# Altium schematic sheet Battery.SchDoc
size A4; SheetNumber: 3; SheetTotal: 6
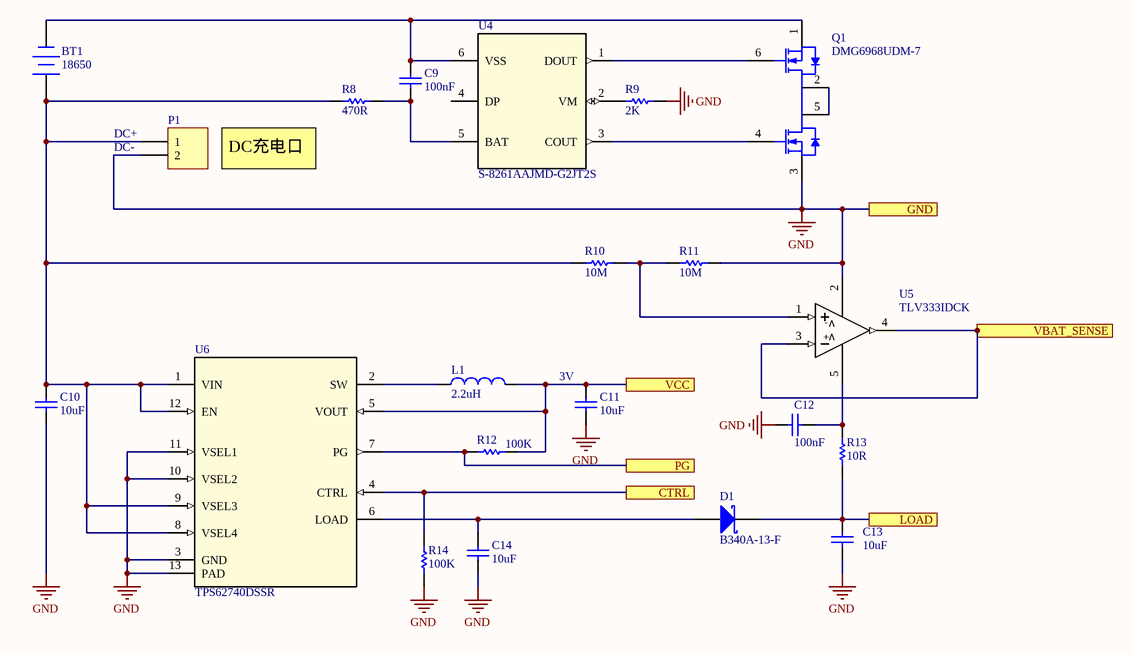
[diagram p0: Battery.SchDoc]

## Parts
BT1  18650  [CP1X2]
C9  100nF  [R0603_C]
C10  10uF  [R0805_C]
C11  10uF  [R0805_C]
C12  100nF  [R0603_C]
C13  10uF  [R0805_C]
C14  10uF  [R0805_C]
D1  B340A-13-F  [SMA(DO-214AC)_S2]
L1  2.2uH  [NR2016]
P1  Header 2  [CP1X2]  (value not drawn)
Q1  DMG6968UDM-7  [DBV0006A_N]
R8  470R  [R0603_R]
R9  2K  [R0603_R]
R10  10M  [R0603_R]
R11  10M  [R0603_R]
R12  100K  [R0603_R]
R13  10R  [R0603_R]
R14  100K  [R0603_R]
U4  S-8261AAJMD-G2JT2S  [DBV0006A_N]
U5  TLV333IDCK  [DCK0005A_N]
U6  TPS62740DSSR  [DSS0012A]

## Ports
CTRL, GND, LOAD, PG, VBAT_SENSE, VCC

## Nets
GND: C10.1 C11.1 C12.1 C13.1 C14.1 P1.2 Q1.3(S2) R9.2 R11.1 R14.1 U5.2(V-) U6.3(GND) U6.10(VSEL2) U6.11(VSEL1) U6.13(PAD) ; port GND
CTRL: R14.2 U6.4(CTRL) ; port CTRL
LOAD: C13.2 D1.2(K) R13.2 ; port LOAD
PG: R12.1 U6.7(PG) ; port PG
VBAT_SENSE: U5.3(IN-) U5.4(OUT) ; port VBAT_SENSE
VCC: C11.2 L1.2 R12.2 U6.5(VOUT) ; port VCC
NetBT1_1: BT1.1(+) C10.2 P1.1 R8.1 R10.2 U6.1(VIN) U6.8(VSEL4) U6.9(VSEL3) U6.12(EN)
NetBT1_2: BT1.2(-) C9.1 Q1.1(S1) U4.6(VSS)
NetC9_2: C9.2 R8.2 U4.5(BAT)
NetC12_2: C12.2 R13.1 U5.5(V+)
NetC14_2: C14.2 D1.1(A) U6.6(LOAD)
NetL1_1: L1.1 U6.2(SW)
NetQ1_2: Q1.2(D1/D2) Q1.5(D1/D2)
NetQ1_4: Q1.4(G2) U4.3(COUT)
NetQ1_6: Q1.6(G1) U4.1(DOUT)
NetR9_1: R9.1 U4.2(VM)
NetR10_1: R10.1 R11.2 U5.1(IN+)

Not connected (* = marked no-connect by the designer): U4 4(DP)

## Notes on the sheet
- (near P1) DC+
- (near P1) DC-
- DC充电口
- (near C11) 3V
- Page
- of

## Library data of the parts
BT1 = Battery_18650_DIP: 18650单节直插电池仓; 型号: DIP-18650; 封装: DIP; 类型: 电池盒/电池座; System: Connector; 厂家: -; 订货编码: -
C9 C12 = 100nF/0603/50V: 精度 ±10% / 容值 100nF / 额定电压 50V / 温漂系数（介质材料) X7R; 厂家: FH(风华); 型号: 0603B104K500NT; 封装: 0603; 类型: Capacitor; 订货编码: C30926
C10 C11 C13 C14 = 10uF/0805/16V: 精度 ±10% / 容值 10uF / 额定电压 16V / 温漂系数（介质材料) X7R; 厂家: FH(风华); 型号: 0805B106K160NT; 封装: 0805; 类型: Capacitor; 订货编码: C92341
D1 = B340A-13-F: 直流反向耐压（Vr） 40V / 平均整流电流（Io） 3A / 正向压降（Vf） 550mV @ 3A; 厂家: DIODES(美台); 封装: SMA; 类型: 肖特基二极管; 订货编码: C85098; 型号: B340A-13-F
L1 = 2.2uH/NR2016: 精度 ±20% / 饱和电流 1.3A / 温升电流1.15A / 直流电阻（内阻） 175mΩ / 电感值 2.2uH; 厂家: Sunlord(顺络); 型号: SPH201610U2R2MT; 类型: Inductor; 订货编码: C96796; 封装: NR2016
P1 = Header 2: Header, 2-Pin; 厂家: /; System: Connector; 型号: /; 封装: /; 类型: /; 订货编码: /
Q1 = DMG6968UDM-7: 漏源电压（Vdss） 20V / 连续漏极电流（Id）（25°C 时） 6.5A / 栅源极阈值电压 900mV @ 250uA / 漏源导通电阻 24mΩ @ 6.5A,4.5V / 最大功率耗散（Ta=25°C） 850mW / 类型 双N沟道(共漏); 厂家: DIODES(美台); 封装: SOT23-6; 类型: MOS(场效应管); 订货编码: C151635; 型号: DMG6968UDM-7
R8 = 470R/0603: 精度 ±1% / 温度系数 ±100ppm/℃ / 功率 0.1W; 厂家: FH(风华); 型号: RS-03K4700FT; 类型: Resistor; 订货编码: C116694; 封装: 0603
R9 = 2K/0603: 精度 ±1% / 阻值 2kΩ / 温度系数 ±100ppm/℃ / 功率 0.1W; 厂家: FH(风华); 型号: RS-03K2001FT; 类型: Resistor; 订货编码: C115336; 封装: 0603
R10 R11 = 10M/0603: 温度系数 ±250ppm/℃ / 精度 ±1% / 阻值 10MΩ / 功率 0.1W; 厂家: FH(风华); 型号: RS-03L1005FT; 类型: Resistor; 订货编码: C322040; 封装: 0603
R12 R14 = 100K/0603: 精度 ±1% / 阻值 100kΩ / 温度系数 ±100ppm/℃ / 功率 0.1W; 厂家: FH(风华); 型号: RS-03K1003FT; 类型: Resistor; 订货编码: C115320; 封装: 0603
R13 = 10R/0603: 精度 ±1% / 阻值 10Ω / 温度系数 ±100ppm/℃ / 功率 0.1W; 厂家: FH(风华); 型号: RS-03K10R0FT; 类型: Resistor; 订货编码: C136596; 封装: 0603
U4 = S-8261AAJMD-G2JT2S: 单节电池保护芯片 / 过充4.325V / 过放2.5V / 过流150mV; 厂家: ABLIC(艾普凌科); 封装: SOT23-6; 类型: 电池保护芯片; 订货编码: C125801; 型号: S-8261AAJMD-G2JT2S
U5 = TLV333IDCK: 电源电压 1.8V ~ 5.5V, ±0.9V ~ 2.75V / 增益带宽积（GBP） 350kHz / 压摆率（SR） 0.16 V/us / 工作温度 -40°C ~ 125°C /; 厂家: TI(德州仪器); 封装: SC-70-5; 类型: 运放; 订货编码: C181502; 型号: TLV333IDCK
U6 = TPS62740DSSR: DCDC; 厂家: TI(德州仪器); 类型: 电源芯片; 订货编码: C128606; 型号: TPS62740DSSR; 封装: DSS0012A